# EAGLE design lm2941[out5v] (EAGLE 9.6.2)
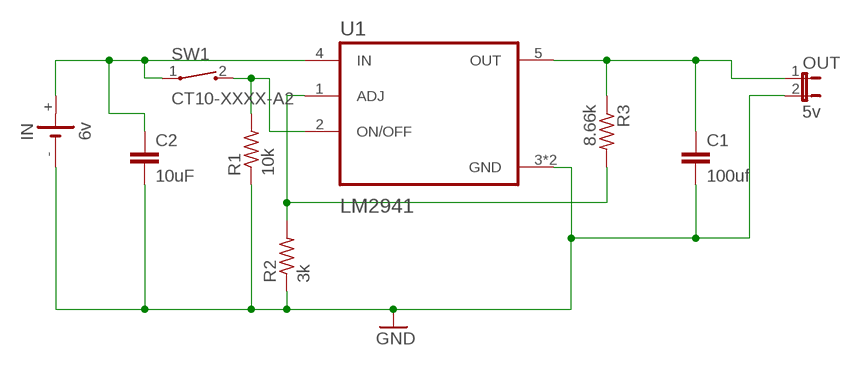
[diagram p0: schematic, sheet 1]

## Parts
C1  100uf  C5/3  [C5B3]
C2  10uF  C5/3  [C5B3]
IN  6v  SL-160AA/PR  [SL-160AA/PR]
OUT  5v  JP1E  [JP1]
R1  10k  R-US_0207/10  [0207/10]
R2  3k  R-US_0207/10  [0207/10]
R3  8.66k  R-US_0207/10  [0207/10]
SW1  CT10-XXXX-A2  [CT10-XXXX-A2]
U1  LM2941  LM2941S  [VREG_TPS79625KTTR]

## Nets
GND: C1.2 C2.2 IN.- OUT.2 R1.1 R2.1 U1.3(GND) U1.6(GND)
N$1: C2.1 IN.+ SW1.1 U1.4(IN)
N$2: R2.2 R3.2 U1.1(ADJ)
N$4: R1.2 SW1.2 U1.2(ON/OFF)
N$8: C1.1 OUT.1 R3.1 U1.5(OUT)

## Library data of the parts
C1 C2 = capacitor-wima:C: CAPACITOR naming: grid - package width
IN = battery:SL-160AA/PR: LI BATTERY Sonnenschein
OUT = jumper:JP1E: JUMPER
R1-R3 = rcl:R-US_: RESISTOR, American symbol; SPICEPREFIX: R
SW1 = switch-coto:CT10-XXXX-: CT10 Series Molded Switch Source: www.cotorelay.com .. Coto_Technology__CT10-1530-G1.pdf
U1 = LM2941S:LM2941S: Check prices <https://pricing.snapeda.com/search/part/LM2941S/?ref=eda>; AVAILABILITY: Warning; DESCRIPTION: 1-A, 26-V, high-PSRR, adjustable low-dropout voltage regulator with enable from -40C to +125C 5-DDPAK/TO-263 -40 to 125; MF: Texas Instruments; MP: LM2941S; PACKAGE: TO-263-5 Texas Instruments; PRICE: None; PURCHASE-URL: https://pricing.snapeda.com/search/part/LM2941S/?ref=eda

## Board
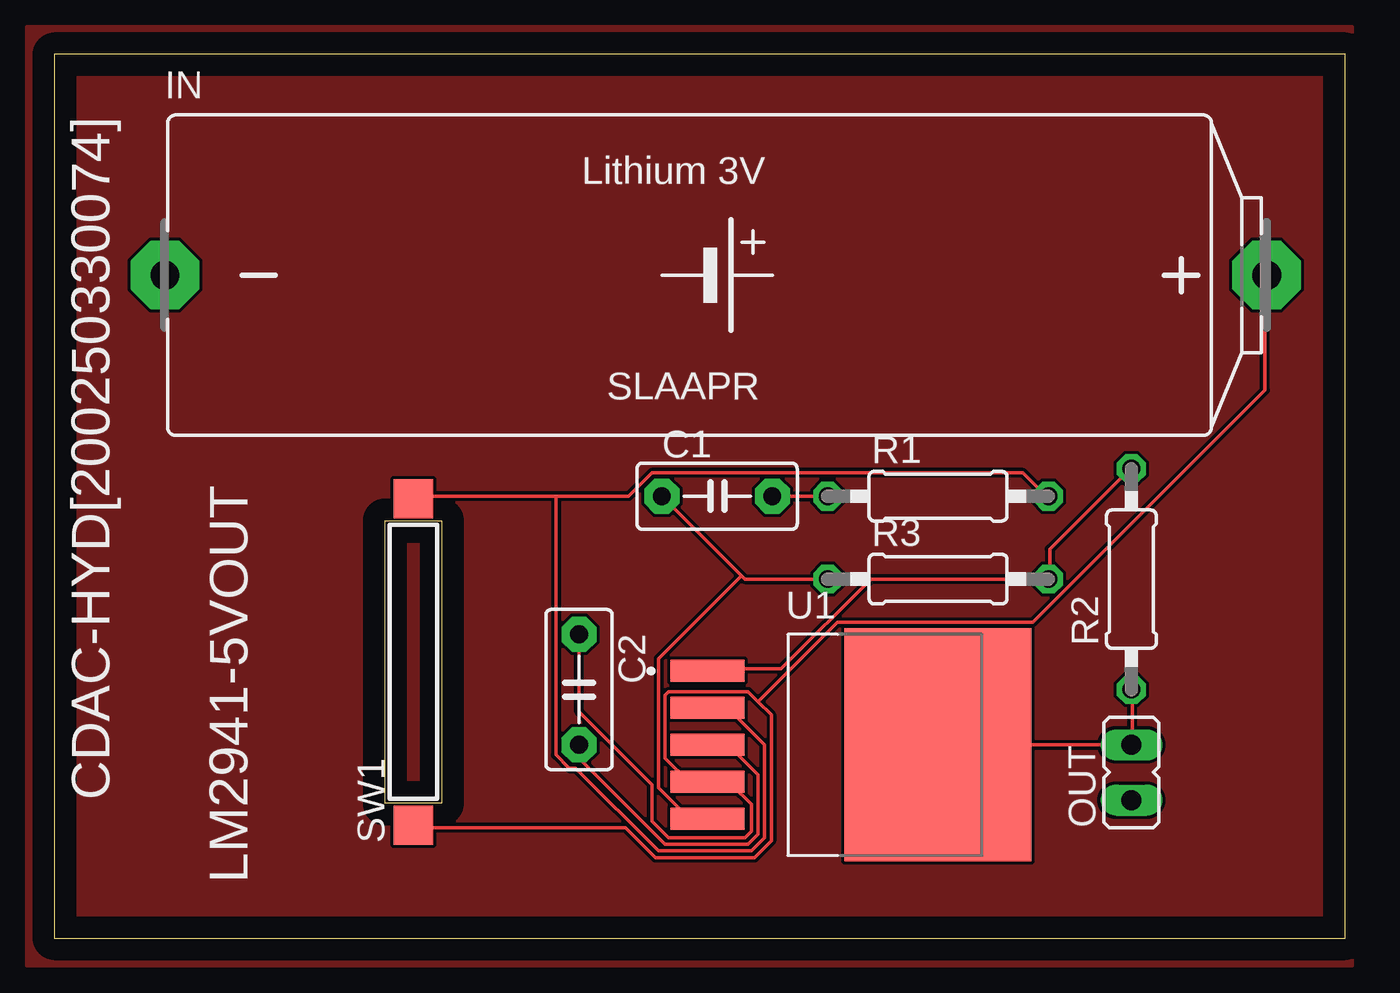
[diagram p1: board, top side]
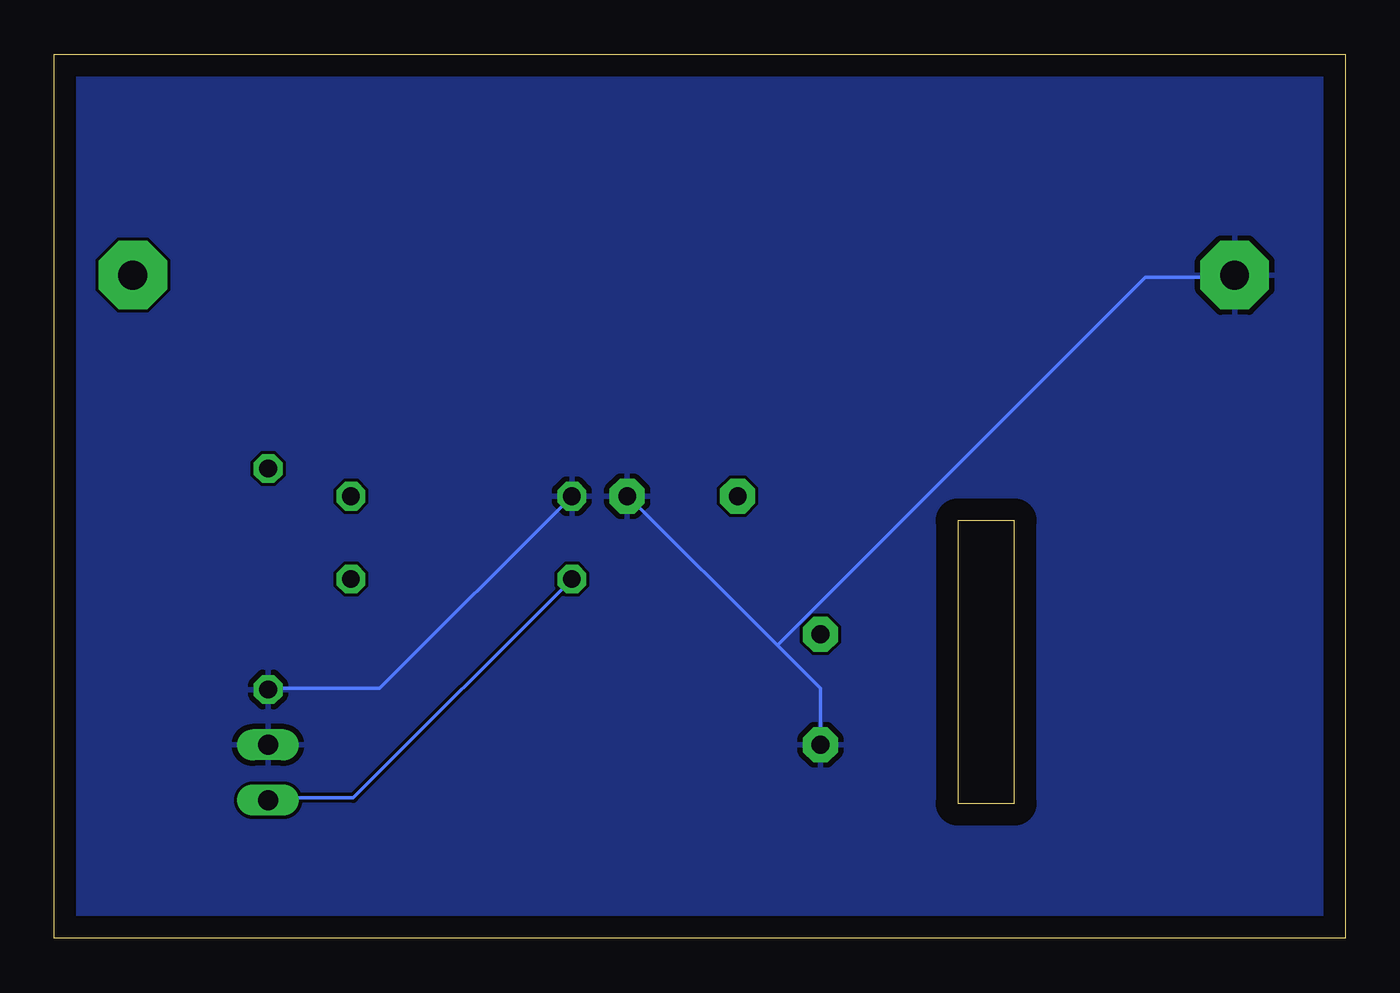
[diagram p2: board, bottom side, seen from below]

Size 59.36 x 40.63 mm. Coordinates in mm from the lower left corner, seen from the top.
Outline: 0,0 59.36,0 59.36,40.63 0,40.63 0,0
Copper layers (1*16): Top 0.035mm / dielectric 1.5mm / Bottom 0.035mm
Design rules "default": minimum track width 6mil, minimum drill 0.35mm, track to track 6mil, track to pad 6mil, pad to pad 6mil, via to via 6mil, smd to smd 6mil, copper to edge 40mil, drill to drill 6mil, minimum pad ring 10mil, minimum via ring 8mil, stop-mask expansion 4mil, vias tented up to drill 0mil, thermal gap 10mil

### Footprints (pad centres in the part's own frame; a part is rotated, then mirrored left to right if it is on the bottom)
C5B3 = drill 0.813 pad 1.6 octagon: 1 -2.54,0; 2 2.54,0
SL-160AA/PR = drill 1.321 pad 3.15 octagon: + 25.273,0; - -25.4,0
JP1 = drill 0.914 long: 1 0,-1.27; 2 0,1.27
0207/10 = drill 0.813 octagon: 1 -5.08,0; 2 5.08,0
CT10-XXXX-A2 = smd 1.8 x 1.8: 1 -7.5,0; 2 7.5,0
VREG_TPS79625KTTR = smd 3.4 x 1: 1 -10.6,3.4; 2 -10.6,1.7; 3 -10.6,0; 4 -10.6,-1.7; 5 -10.6,-3.4 | smd 8.6 x 10.7: 6 0,0

### Placement (x,y rotation side)
C1  30.48,20.32 0 top
C2  24.13,11.43 270 top
IN  30.48,30.48 0 top
OUT  49.53,7.62 0 top
R1  40.64,20.32 0 top
R2  49.53,16.51 90 top
R3  40.64,16.51 0 top
SW1  16.51,12.7 90 top
U1  40.64,8.89 0 top

### Tracks (layer width: path | path; a pad name or v marks a point on that pad's centre or on a via)
GND
  Top 0.152: R2.1 49.58,11.33 49.58,8.89 OUT.2 U1.6 | C1.2 R1.1 | U1.3 30.99,8.89 32.36,7.52 32.36,4.78 31.9,4.32 28.09,4.32 24.13,8.28 C2.2
  Bottom 0.152: C2.2 24.13,11.48 26.11,13.46 | 26.11,13.46 32.97,20.32 C1.2 | 26.11,13.46 9.2,30.38 5.08,30.38 IN.- | R1.1 44.4,11.48 49.43,11.48 R2.1
  pour Bottom: -2.54,43.18 60.96,43.18 60.96,-2.54 -2.54,-2.54
N$1
  Top 0.152: 32.36,10.87 31.9,11.33 28.24,11.33 28.09,11.18 28.09,8.28 29.16,7.21 29.92,7.21 U1.4 30.07,7.06 31.14,7.06 32.05,6.15 32.05,4.93 31.75,4.62 28.24,4.62 27.48,5.38 27.48,7.06 24.13,10.41 C2.1 | 32.36,10.87 32.97,10.26 32.97,4.47 32.21,3.71 27.63,3.71 26.26,5.08 16.51,5.08 SW1.1 | 32.36,10.87 36.02,14.53 45.01,14.53 55.68,25.2 55.68,30.38 IN.+
N$2
  Top 0.152: R2.2 49.43,21.54 45.77,17.88 45.77,16.51 R3.2 37.54,16.51 33.43,12.39 30.07,12.39 U1.1
N$4
  Top 0.152: 23.06,20.32 26.42,20.32 27.48,21.39 44.55,21.39 45.62,20.32 R1.2 | 23.06,20.32 16.51,20.32 SW1.2 | 23.06,20.32 23.06,8.43 23.67,7.82 23.98,7.82 27.79,4.01 32.05,4.01 32.66,4.62 32.66,8.89 30.99,10.57 30.07,10.57 U1.2
N$8
  Top 0.152: R3.1 31.75,16.51 31.6,16.66 | C1.1 31.6,16.66 | 31.6,16.66 27.79,12.85 27.79,6.91 29.16,5.54 29.92,5.54 U1.5
  Bottom 0.152: R3.1 45.62,6.45 49.43,6.45 OUT.1
TOP
  pour Top: -1.27,41.91 59.69,41.91 59.69,-1.27 -1.27,-1.27

### Text on the board
tPlace: CDAC-HYD[200250330074] | LM2941-5VOUT